# EAGLE schematic tinydie (EAGLE 6.4)
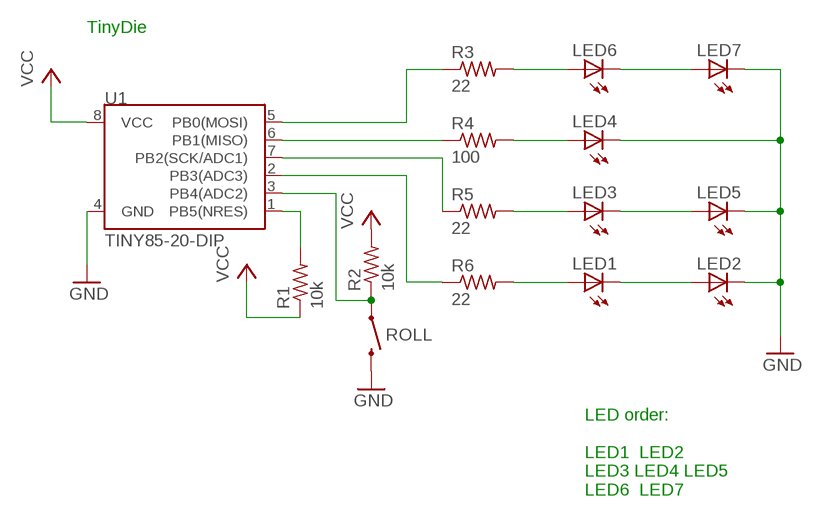
[diagram p0: schematic, sheet 1]

## Parts
LED1  LED3MM  [LED3MM]
LED2  LED3MM  [LED3MM]
LED3  LED3MM  [LED3MM]
LED4  LED3MM  [LED3MM]
LED5  LED3MM  [LED3MM]
LED6  LED3MM  [LED3MM]
LED7  LED3MM  [LED3MM]
R1  10k  R-US_0207/7  [0207/7]
R2  10k  R-US_0207/7  [0207/7]
R3  22  R-US_0207/7  [0207/7]
R4  100  R-US_0207/7  [0207/7]
R5  22  R-US_0207/7  [0207/7]
R6  22  R-US_0207/7  [0207/7]
ROLL  SWITCH-MOMENTARY-2  [TACTILE_SWITCH_TALL]
U1  TINY85-20-DIP  ATTINY45TINY85-20-DIP  [DIP08]

## Nets
GND: LED2.K(C) LED4.K(C) LED5.K(C) LED7.K(C) ROLL.B2 U1.4(GND)
L3: LED3.K(C) LED5.A
LED6: LED6.K(C) LED7.A
N$1: LED6.A R3.2
N$4: LED1.K(C) LED2.A
N$5: LED3.A R5.2
N$6: LED1.A R6.2
N$7: LED4.A R4.2
N$8: R3.1 U1.5(PB0(MOSI))
N$9: R4.1 U1.6(PB1(MISO))
N$10: R5.1 U1.7(PB2(SCK/ADC1))
N$11: R6.1 U1.2(PB3(ADC3))
N$12: R2.1 ROLL.A2 U1.3(PB4(ADC2))
N$13: R1.2 U1.1(PB5(NRES))
VCC: R1.1 R2.2 U1.8(VCC)

## Notes on the sheet
- TinyDie
- LED order:
  
  LED1		LED2
  LED3	LED4	LED5
  LED6		LED7

## Library data of the parts
LED1-LED7 = adafruit:LED: LED OSRAM: - CHIPLED LG R971, LG N971, LY N971, LG Q971, LY Q971, LO R971, LY R971 LH N974, LH R974 LS Q976, LO Q976, LY Q976 LO Q996 - Hyper CHIPLED LW Q18S LB Q993, LB Q99A, LB R99A - SideLED LS A670, LO A670, LY A670, LG A670, LP A670 LB A673, LV A673, LT A673, LW A673 LH A674 LY A675 LS A676, LA A676, LO A676, LY A676, LW A676 LS A679, LY A679, LG A679 - Hyper Micro SIDELED® LS Y876, LA Y876, LO Y876, LY Y876 LT Y87S - SmartLED LW L88C, LW L88S LB L89C, LB L89S, LG L890 LS L89K, LO L89K, LY L89K LS L896, LA L896, LO L896, LY L896 - TOPLED LS T670, LO T670, LY T670, LG T670, LP T670 LSG T670, LSP T670, LSY T670, LOP T670, LYG T670 LG T671, LOG T671, LSG T671 LB T673, LV T673, LT T673, LW T673 LH T674 LS T676, LA T676, LO T676, LY T676, LB T676, LH T676, LSB T676, LW T676 LB T67C, LV T67C, LT T67C, LS T67K, LO T67K, LY T67K, LW E67C LS E67B, LA E67B, LO E67B, LY E67B, LB E67C, LV E67C, LT E67C LW T67C LS T679, LY T679, LG T679 LS T770, LO T770, LY T770, LG T770, LP T770 LB T773, LV T773, LT T773, LW T773 LH T774 LS E675, LA E675, LY E675, LS T675 LS T776, LA T776, LO T776, LY T776, LB T776 LHGB T686 LT T68C, LB T68C - Hyper Mini TOPLED® LB M676 - Mini TOPLED Santana® LG M470 LS M47K, LO M47K, LY M47K Source: http://www.osram.convergy.de/
R1-R6 = adafruit:R-US_: RESISTOR, American symbol
ROLL = SparkFun-Electromechanical:SWITCH-MOMENTARY-2: Various NO switches- pushbuttons, reed, etc
U1 = SparkFun-DigitalIC:ATTINY45: Atmel 8-pin 2/4/8kB flash uC; PROD_ID: IC-09445